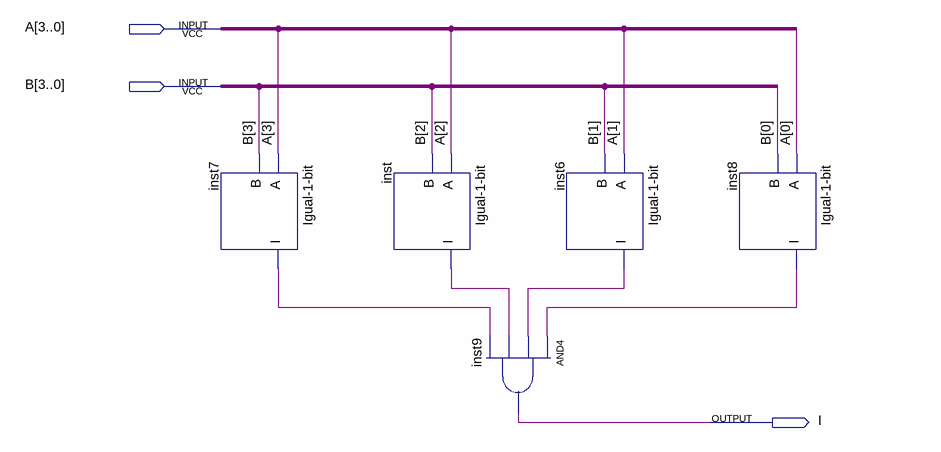
[diagram p0: schematic sheet]
// Quartus schematic Igual-4-bits.bdf as structural Verilog: 5 symbols, 3 pins
module \Igual-4-bits  (
  input  [3:0] A,
  input  [3:0] B,
  output I
);

  wire inst6_i, inst7_i, inst8_i, inst_i;

  \Igual-1-bit  inst7 (.A(A[3]), .B(B[3]), .I(inst7_i));
  \Igual-1-bit  inst (.A(A[2]), .B(B[2]), .I(inst_i));
  and inst9 (I, inst8_i, inst6_i, inst_i, inst7_i);
  \Igual-1-bit  inst6 (.A(A[1]), .B(B[1]), .I(inst6_i));
  \Igual-1-bit  inst8 (.A(A[0]), .B(B[0]), .I(inst8_i));
endmodule
